# EAGLE design 12_LED_Ring (EAGLE 9.6.2)
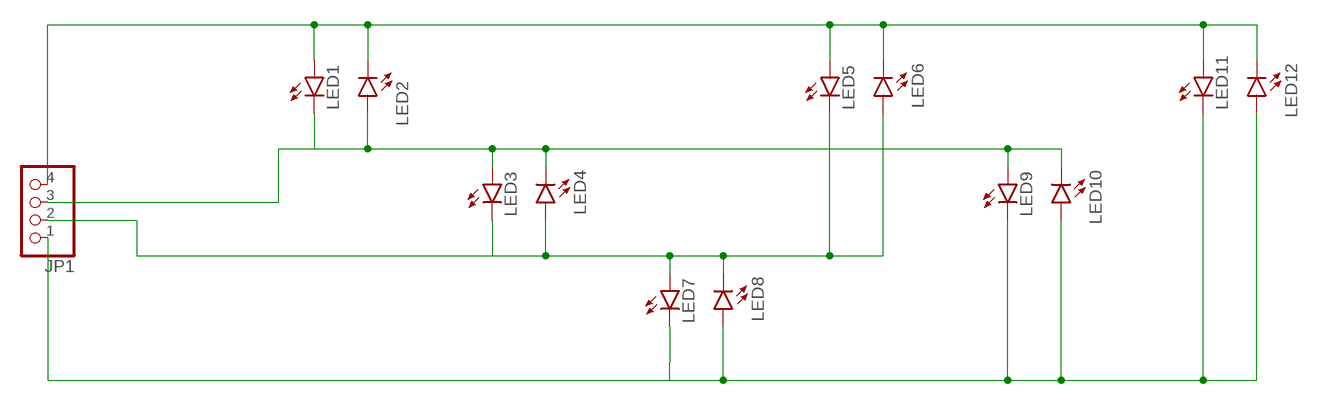
[diagram p0: schematic, sheet 1]

## Parts
JP1  PINHD-1X4  [1X04]
LED1  LED5MM  [LED5MM]
LED2  LED5MM  [LED5MM]
LED3  LED5MM  [LED5MM]
LED4  LED5MM  [LED5MM]
LED5  LED5MM  [LED5MM]
LED6  LED5MM  [LED5MM]
LED7  LED5MM  [LED5MM]
LED8  LED5MM  [LED5MM]
LED9  LED5MM  [LED5MM]
LED10  LED5MM  [LED5MM]
LED11  LED5MM  [LED5MM]
LED12  LED5MM  [LED5MM]

## Nets
N$1: JP1.4 LED1.A LED2.K(C) LED5.A LED6.K(C) LED11.A LED12.K(C)
N$2: JP1.3 LED1.K(C) LED2.A LED3.A LED4.K(C) LED9.A LED10.K(C)
N$3: JP1.2 LED3.K(C) LED4.A LED5.K(C) LED6.A LED7.A LED8.K(C)
N$4: JP1.1 LED7.K(C) LED8.A LED9.K(C) LED10.A LED11.K(C) LED12.A

## Library data of the parts
JP1 = pinhead:PINHD-1X4: PIN HEADER
LED1-LED12 = led:LED: LED OSRAM: - CHIPLED LG R971, LG N971, LY N971, LG Q971, LY Q971, LO R971, LY R971 LH N974, LH R974 LS Q976, LO Q976, LY Q976 LO Q996 - Hyper CHIPLED LW Q18S LB Q993, LB Q99A, LB R99A - SideLED LS A670, LO A670, LY A670, LG A670, LP A670 LB A673, LV A673, LT A673, LW A673 LH A674 LY A675 LS A676, LA A676, LO A676, LY A676, LW A676 LS A679, LY A679, LG A679 - Hyper Micro SIDELED® LS Y876, LA Y876, LO Y876, LY Y876 LT Y87S - SmartLED LW L88C, LW L88S LB L89C, LB L89S, LG L890 LS L89K, LO L89K, LY L89K LS L896, LA L896, LO L896, LY L896 - TOPLED LS T670, LO T670, LY T670, LG T670, LP T670 LSG T670, LSP T670, LSY T670, LOP T670, LYG T670 LG T671, LOG T671, LSG T671 LB T673, LV T673, LT T673, LW T673 LH T674 LS T676, LA T676, LO T676, LY T676, LB T676, LH T676, LSB T676, LW T676 LB T67C, LV T67C, LT T67C, LS T67K, LO T67K, LY T67K, LW E67C LS E67B, LA E67B, LO E67B, LY E67B, LB E67C, LV E67C, LT E67C LW T67C LS T679, LY T679, LG T679 LS T770, LO T770, LY T770, LG T770, LP T770 LB T773, LV T773, LT T773, LW T773 LH T774 LS E675, LA E675, LY E675, LS T675 LS T776, LA T776, LO T776, LY T776, LB T776 LHGB T686 LT T68C, LB T68C - Hyper Mini TOPLED® LB M676 - Mini TOPLED Santana® LG M470 LS M47K, LO M47K, LY M47K Source: http://www.osram.convergy.de LUXEON: - LUMILED® LXK2-PW12-R00, LXK2-PW12-S00, LXK2-PW14-U00, LXK2-PW14-V00 LXK2-PM12-R00, LXK2-PM12-S00, LXK2-PM14-U00 LXK2-PE12-Q00, LXK2-PE12-R00, LXK2-PE12-S00, LXK2-PE14-T00, LXK2-PE14-U00 LXK2-PB12-K00, LXK2-PB12-L00, LXK2-PB12-M00, LXK2-PB14-N00, LXK2-PB14-P00, LXK2-PB14-Q00 LXK2-PR12-L00, LXK2-PR12-M00, LXK2-PR14-Q00, LXK2-PR14-R00 LXK2-PD12-Q00, LXK2-PD12-R00, LXK2-PD12-S00 LXK2-PH12-R00, LXK2-PH12-S00 LXK2-PL12-P00, LXK2-PL12-Q00, LXK2-PL12-R00 Source: www.luxeon.com KINGBRIGHT: KA-3528ASYC Source: www.kingbright.com

## Board
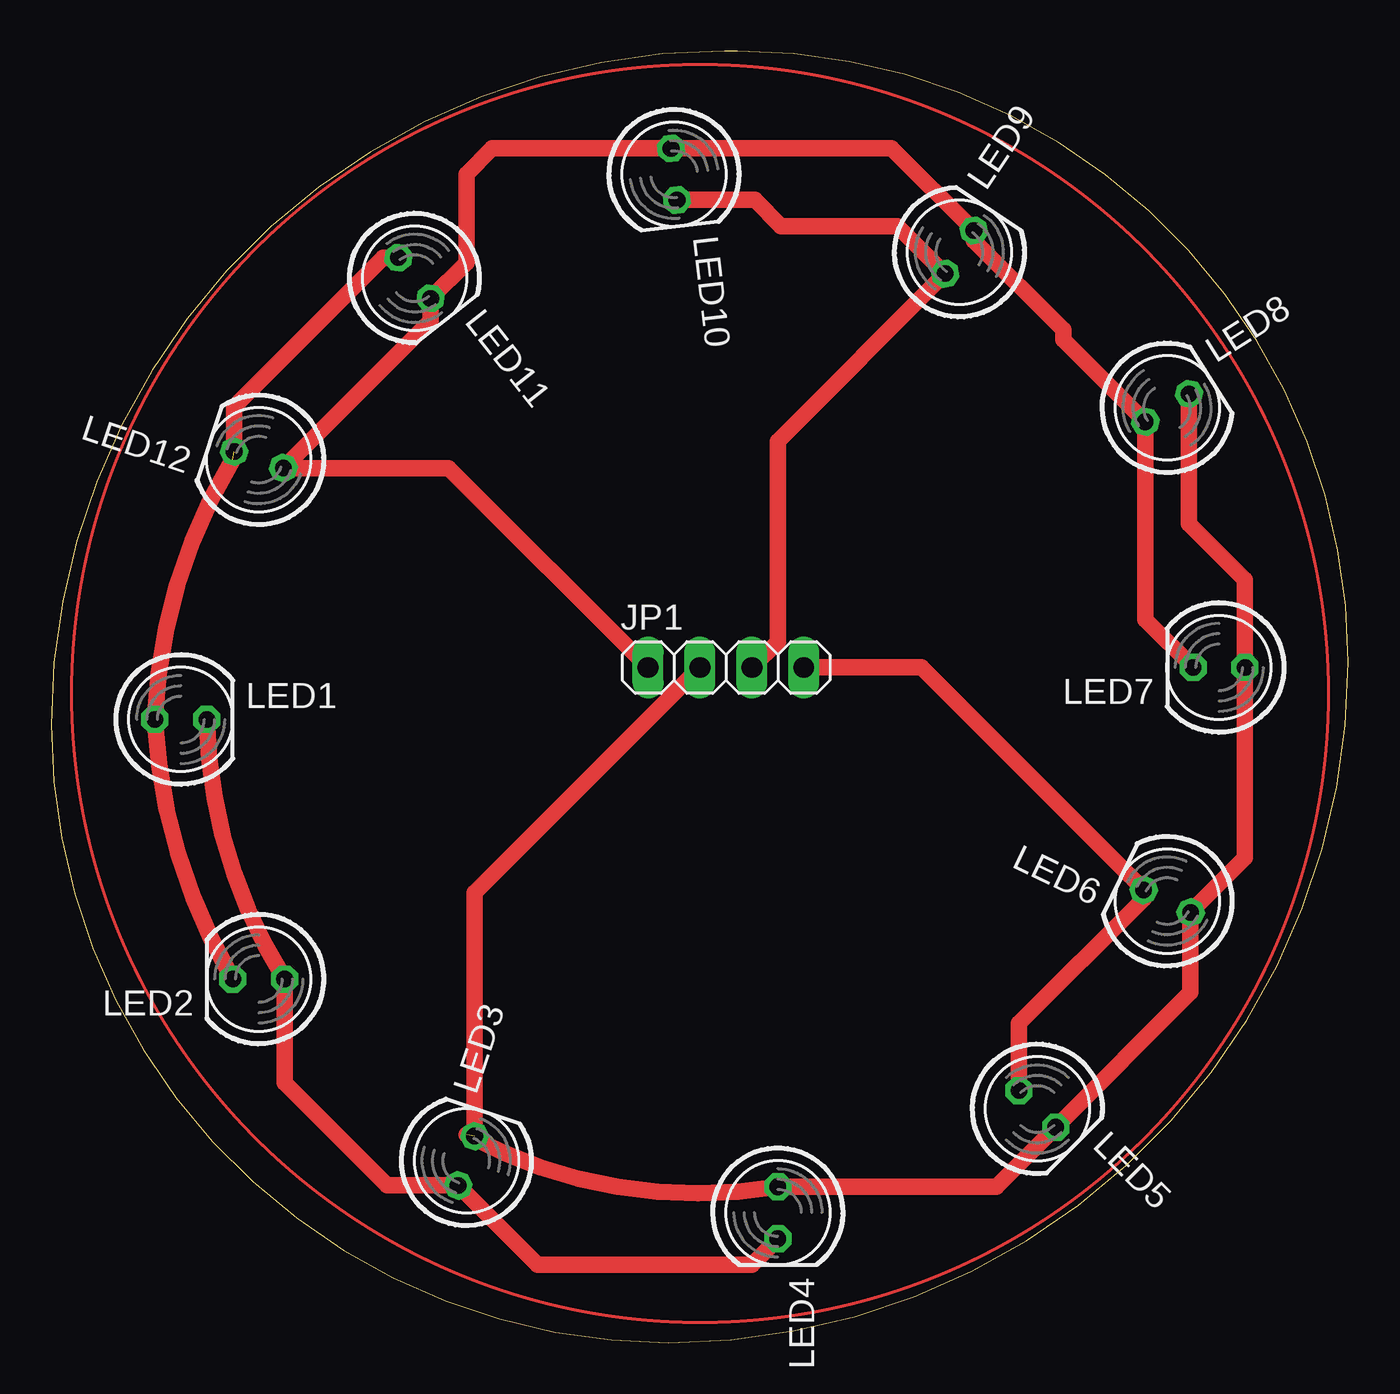
[diagram p1: board, top side]
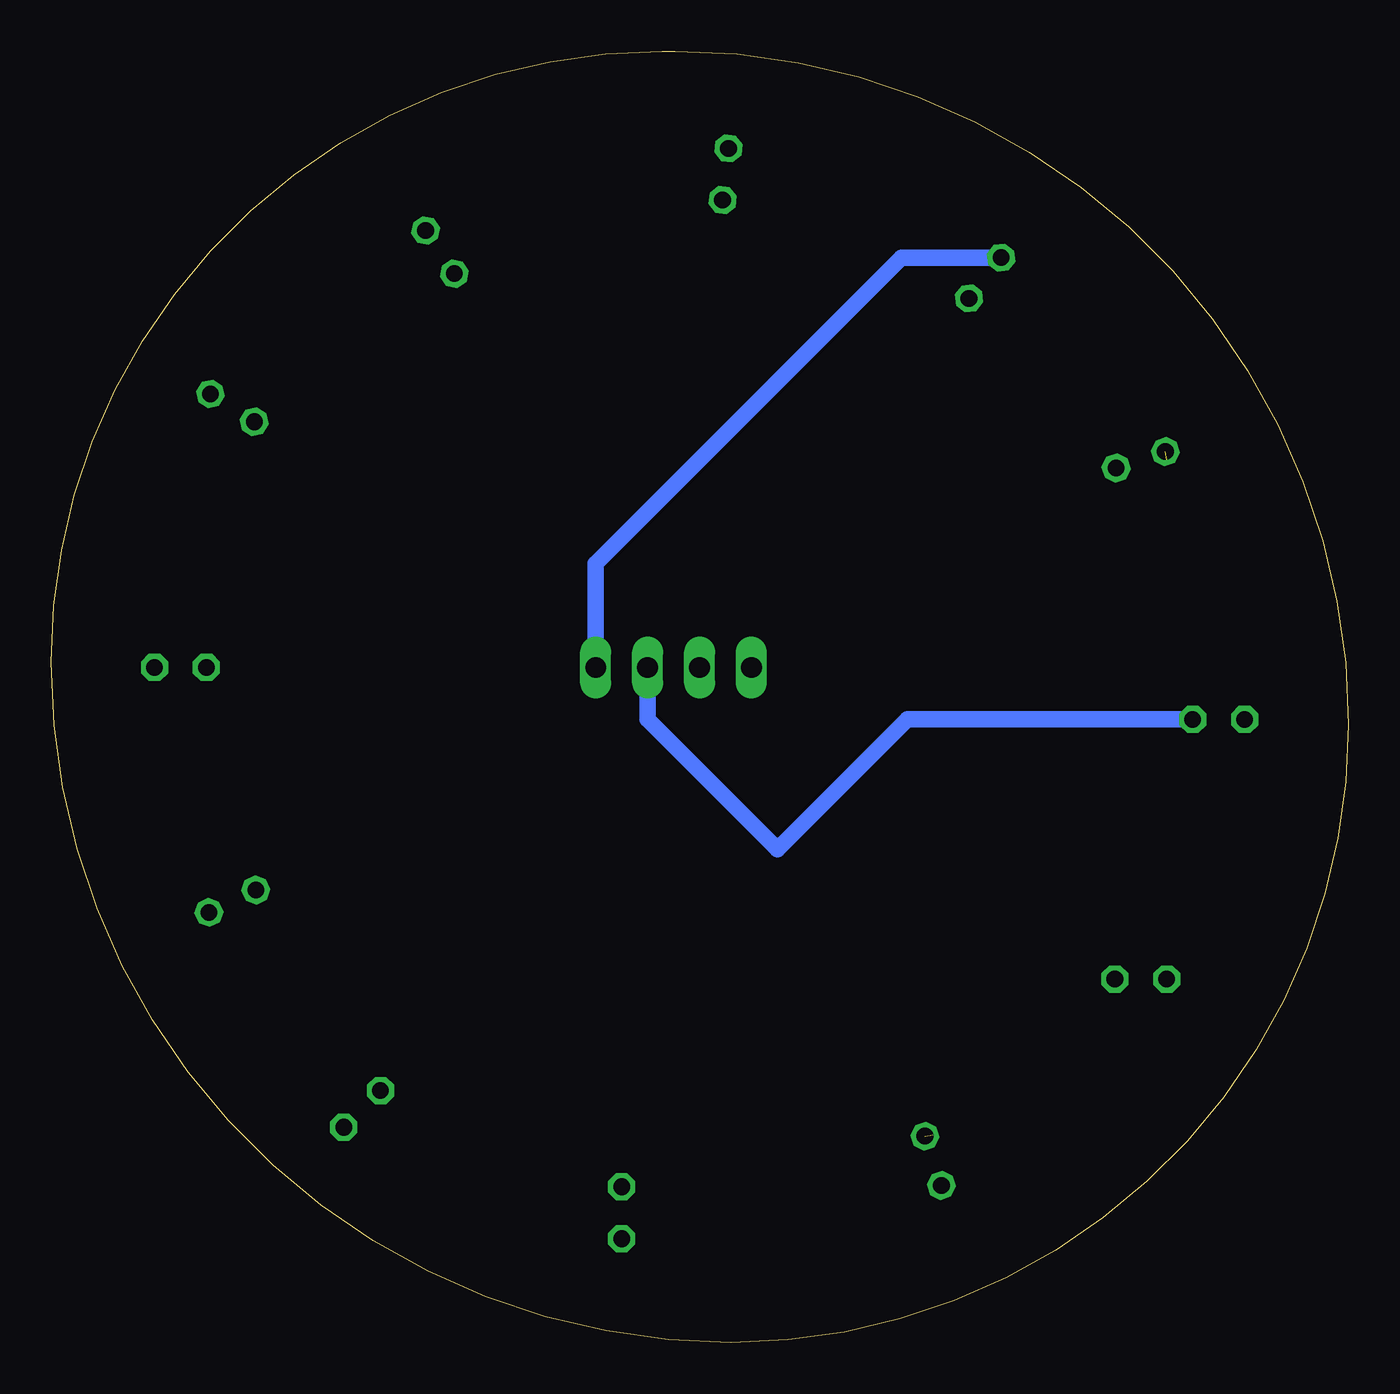
[diagram p2: board, bottom side, seen from below]

Size 63.48 x 63.17 mm. Coordinates in mm from the lower left corner, seen from the top.
Outline: 0,30.21 arc90 30.21,0 arc90 63.48,33.27 arc90 33.58,63.17 32.96,63.17 arc90 0,30.21
Copper layers (1*16): Top 0.035mm / dielectric 1.5mm / Bottom 0.035mm
Design rules "default": minimum track width 6mil, minimum drill 0.35mm, track to track 6mil, track to pad 6mil, pad to pad 6mil, via to via 6mil, smd to smd 6mil, copper to edge 40mil, drill to drill 6mil, minimum pad ring 10mil, minimum via ring 8mil, stop-mask expansion 4mil, vias tented up to drill 0mil, thermal gap 10mil

### Footprints (pad centres in the part's own frame; a part is rotated, then mirrored left to right if it is on the bottom)
1X04 = drill 1.016 long: 1 -3.81,0; 2 -1.27,0; 3 1.27,0; 4 3.81,0
LED5MM = drill 0.813 octagon: A -1.27,0; K 1.27,0

### Placement (x,y rotation side)
JP1  33.02,33.02 0 top
LED1  6.35,30.48 0 top
LED2  10.16,17.78 180 top
LED3  20.32,8.89 71.5 top
LED4  35.56,6.35 270 top
LED5  48.26,11.43 315 top
LED6  54.61,21.59 154.4 top
LED7  57.15,33.02 180 top
LED8  54.61,45.72 32.4 top
LED9  44.45,53.34 56.3 top
LED10  30.48,57.15 276.6 top
LED11  17.78,52.07 308.3 top
LED12  10.16,43.18 161.5 top

### Tracks (layer width: path | path; a pad name or v marks a point on that pad's centre or on a via)
N$1  (1 unrouted)
  Top 0.813: LED2.K arc-27 LED1.A arc-29 8.89,43.18 | LED5.A 47.36,15.61 53.47,21.71 LED6.K 42.58,33.02 JP1.4 | LED12.K 8.96,45.79 16.24,53.07 LED11.A
  Bottom 0.813: JP1.4 36.83,38.1 21.86,53.07 LED11.A
N$2
  Top 0.813: LED1.K arc31 LED2.A 11.43,12.7 16.44,7.69 LED3.A 23.79,3.81 34.29,3.81 LED4.K | LED10.K 34.44,55.89 35.71,54.61 41.42,54.61 LED9.A 35.56,44.1 35.56,34.29 JP1.3
  Bottom 0.813: LED1.K 21.59,30.48 27.94,24.13 34.29,30.48 JP1.3
N$3  (1 unrouted)
  Top 0.813: 20.32,10.16 arc38 LED4.A 46.25,7.62 LED5.K 55.76,17.13 LED6.A 58.42,23.71 LED7.A 58.42,37.31 55.68,40.05 LED8.K | LED3.K 20.72,21.99 JP1.2
N$4
  Top 0.813: LED7.K 53.54,35.36 LED8.A 49.53,49.05 49.53,49.53 45.16,53.91 LED9.K 41.13,58.42 30.34,58.42 | 30.34,58.42 LED10.A | 30.34,58.42 21.59,58.42 20.32,57.15 20.32,52.83 LED11.K 18.57,49.98 LED12.A 19.45,42.78 JP1.1
(copper drawn outside any net)
  shapes: Top circle x1